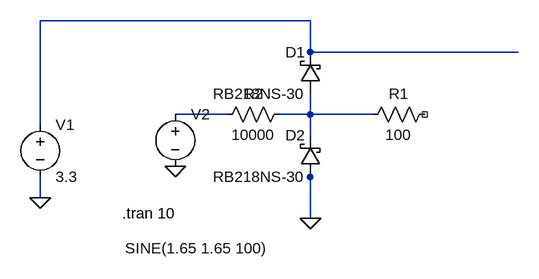
[diagram p0: schematic voltage_protection_circuit.asc]
voltage_protection_circuit.asc, the LTspice schematic file:
Version 4
SHEET 1 880 680
WIRE 224 48 -192 48
WIRE 224 96 224 48
WIRE 544 96 224 96
WIRE 96 192 16 192
WIRE 224 192 224 160
WIRE 224 192 176 192
WIRE 320 192 224 192
WIRE -192 208 -192 48
WIRE 224 224 224 192
WIRE 224 288 224 272
WIRE -192 320 -192 288
WIRE 224 352 224 288
FLAG -192 320 0
FLAG 16 272 0
FLAG 224 352 0
SYMBOL schottky 240 160 R180
WINDOW 0 24 64 Left 2
WINDOW 3 24 0 Left 2
SYMATTR InstName D1
SYMATTR Value RB218NS-30
SYMATTR Description Diode
SYMATTR Type diode
SYMBOL voltage -192 192 R0
WINDOW 123 0 0 Left 0
WINDOW 39 0 0 Left 0
SYMATTR InstName V1
SYMATTR Value 3.3
SYMBOL voltage 16 176 R0
WINDOW 3 -77 222 Left 2
WINDOW 123 24 124 Left 2
WINDOW 39 0 0 Left 0
SYMATTR InstName V2
SYMATTR Value SINE(1.65 1.65 100)
SYMBOL res 416 176 R90
WINDOW 0 0 56 VBottom 2
WINDOW 3 32 56 VTop 2
SYMATTR InstName R1
SYMATTR Value 100
SYMBOL res 192 176 R90
WINDOW 0 0 56 VBottom 2
WINDOW 3 32 56 VTop 2
SYMATTR InstName R2
SYMATTR Value 10000
SYMBOL schottky 240 288 R180
WINDOW 0 24 64 Left 2
WINDOW 3 24 0 Left 2
SYMATTR InstName D2
SYMATTR Value RB218NS-30
SYMATTR Description Diode
SYMATTR Type diode
TEXT -66 344 Left 2 !.tran 10

The netlist it stands for:
* voltage_protection_circuit.asc
D1 N003 N001 RB218NS-30
V1 N001 0 3.3
V2 N002 0 SINE(1.65 1.65 100)
R1 NC_01 N003 100
R2 N003 N002 10000
D2 0 N003 RB218NS-30
.model D D
.lib standard.dio
.tran 10
.backanno
.end